# EAGLE design pitching_v1 (EAGLE 9.5.1)
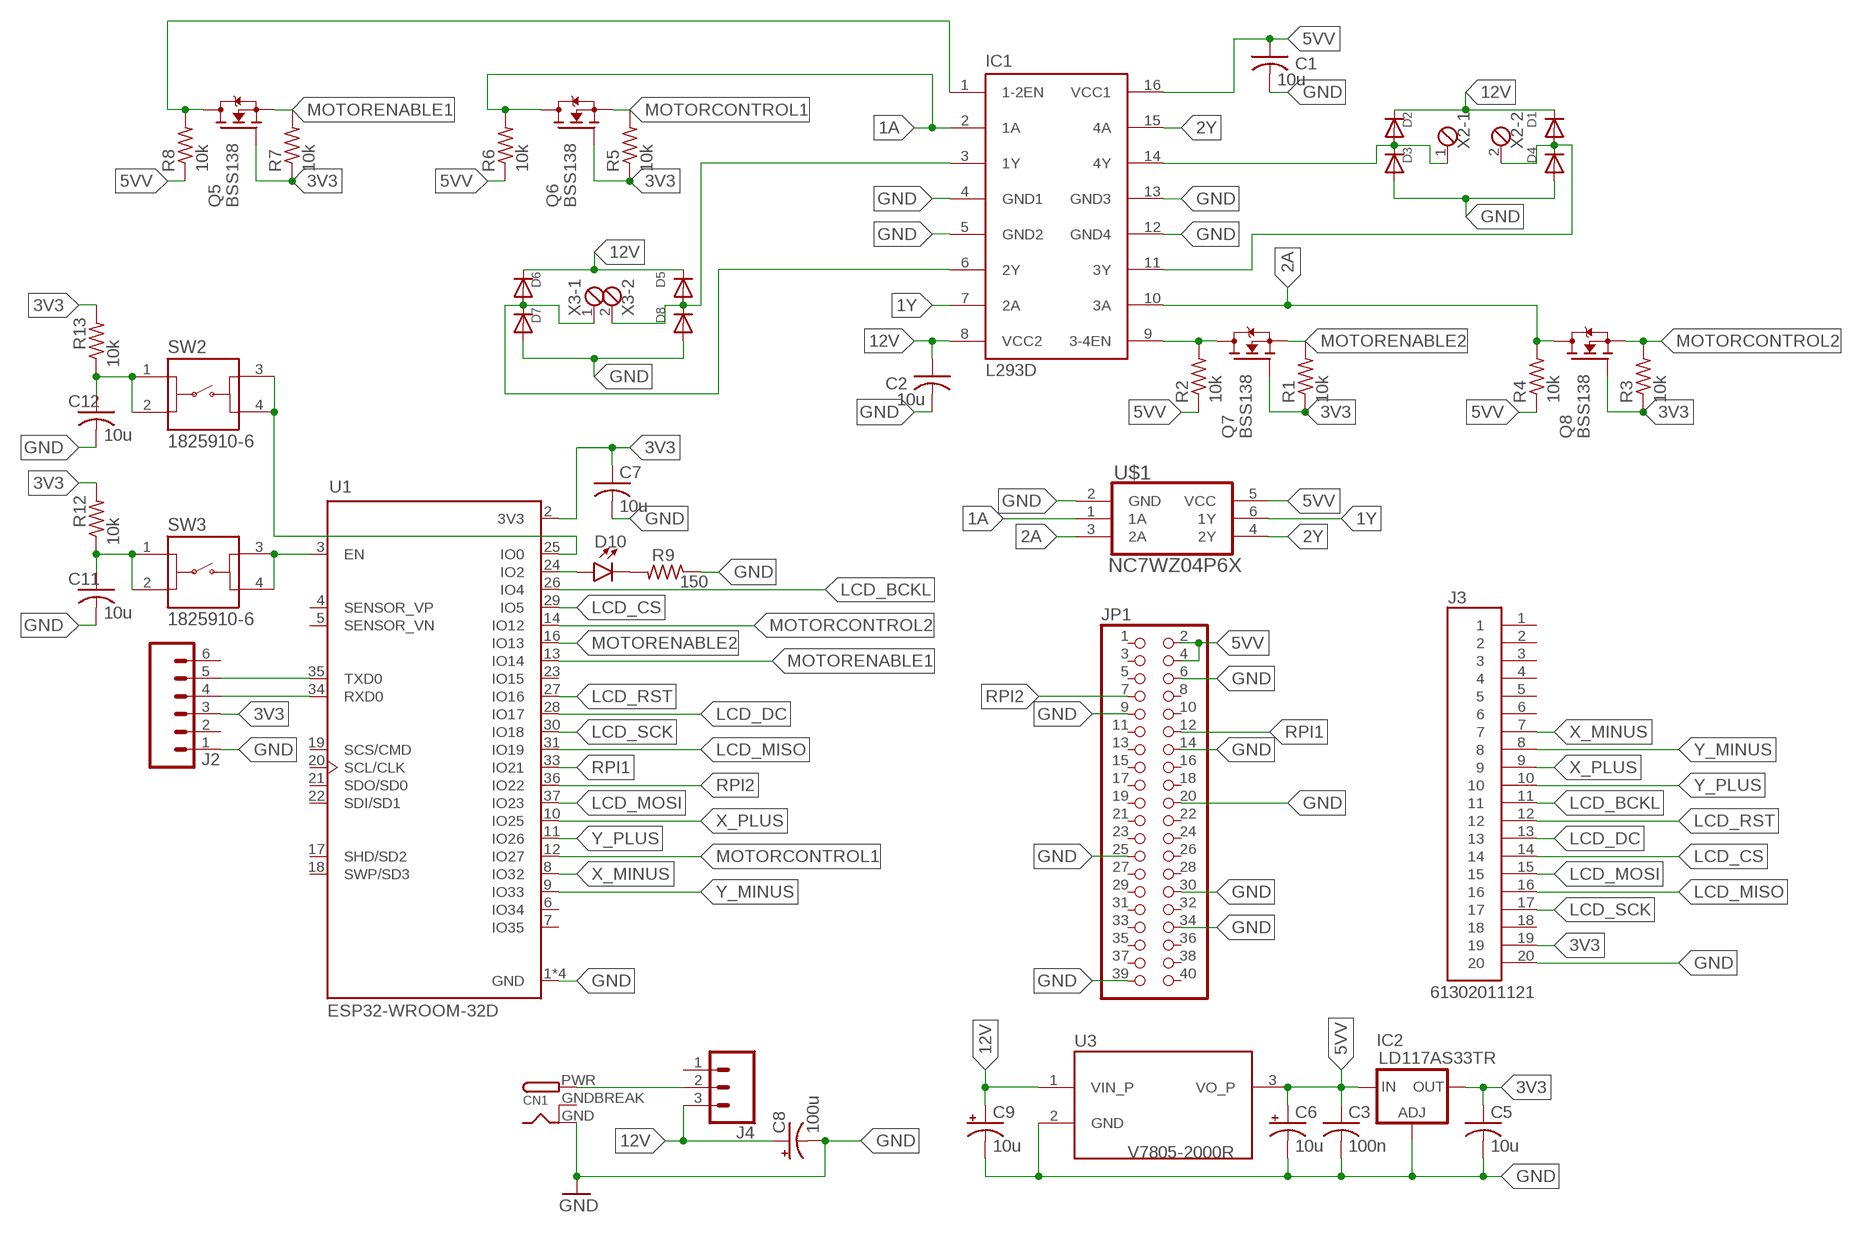
[diagram p0: schematic, sheet 1]

## Parts
C1  10u  C-USC0805  [C0805]
C2  10u  C-USC0805  [C0805]
C3  100n  C-USC0805  [C0805]
C5  10u  C-USC0805  [C0805]
C6  10u  CPOL-US153CLV-0405  [153CLV-0405]
C7  10u  C-USC0805  [C0805]
C8  100u  CPOL-US153CLV-0810  [153CLV-0810]
C9  10u  CPOL-US153CLV-0405  [153CLV-0405]
C11  10u  C-USC0805  [C0805]
C12  10u  C-USC0805  [C0805]
CN1  DCBARRELPTH  [DCJACK_2MM_PTH]
D1  DIODESMA  [SMADIODE]
D2  DIODESMA  [SMADIODE]
D3  DIODESMA  [SMADIODE]
D4  DIODESMA  [SMADIODE]
D5  DIODESMA  [SMADIODE]
D6  DIODESMA  [SMADIODE]
D7  DIODESMA  [SMADIODE]
D8  DIODESMA  [SMADIODE]
D10  LED3MM  [LED_3MM]
IC1  L293D  [DIL16]
IC2  LD117AS33TR  [SOT223]
J2  CONN_06NO_SILK_FEMALE_PTH  [1X06_NO_SILK]
J3  61302011121  [61302011121]
J4  CONN_03  [1X03]
JP1  PINHD-2X20  [2X20]
Q5  BSS138  [SOT23]
Q6  BSS138  [SOT23]
Q7  BSS138  [SOT23]
Q8  BSS138  [SOT23]
R1  10k  R-US_R0805  [R0805]
R2  10k  R-US_R0805  [R0805]
R3  10k  R-US_R0805  [R0805]
R4  10k  R-US_R0805  [R0805]
R5  10k  R-US_R0805  [R0805]
R6  10k  R-US_R0805  [R0805]
R7  10k  R-US_R0805  [R0805]
R8  10k  R-US_R0805  [R0805]
R9  150  R-US_R0805  [R0805]
R12  10k  R-US_R0805  [R0805]
R13  10k  R-US_R0805  [R0805]
SW2  1825910-6  [1825910-6]
SW3  1825910-6  [1825910-6]
U1  ESP32-WROOM-32D  [MODULE_ESP32-WROOM-32D]
U3  V7805-2000R  [CONV_V7805-2000R]
U$1  NC7WZ04P6X  [SOT65P210X110-6N]
X2  MPT2  [2POL254]
X3  MPT2  [2POL254]

## Nets
1A: IC1.2(1A) Q6.3(D) R6.2 U$1.1(1A)
1Y: IC1.7(2A) U$1.6(1Y)
2A: IC1.10(3A) Q8.3(D) R4.2 U$1.3(2A)
2Y: IC1.15(4A) U$1.4(2Y)
3V3: C5.1 C7.1 IC2.4(OUT) J2.3 J3.19 Q5.1(G) Q6.1(G) Q7.1(G) Q8.1(G) R1.1 R3.1 R5.1 R7.1 R12.2 R13.2 U1.2(3V3)
5VV: C1.1 C3.1 C6.+ IC1.16(VCC1) IC2.3(IN) JP1.2 JP1.4 R2.1 R4.1 R6.1 R8.1 U3.3(VO_P) U$1.5(VCC)
12V: C2.1 C8.+ C9.+ D1.C D2.C D5.C D6.C IC1.8(VCC2) J4.3 U3.1(VIN_P)
GND: C1.2 C2.2 C3.2 C5.2 C6.- C7.2 C8.- C9.- C11.2 C12.2 CN1.GND D3.A D4.A D7.A D8.A IC1.4(GND1) IC1.5(GND2) IC1.12(GND4) IC1.13(GND3) IC2.1(ADJ) J2.1 J3.20 JP1.6 JP1.9 JP1.14 JP1.20 JP1.25 JP1.30 JP1.34 JP1.39 R9.1 U1.1(GND) U1.15(GND) U1.38(GND) U1.39(GND) U3.2(GND) U$1.2(GND)
LCD_BCKL: J3.11 U1.26(IO4)
LCD_CS: J3.14 U1.29(IO5)
LCD_DC: J3.13 U1.28(IO17)
LCD_MISO: J3.16 U1.31(IO19)
LCD_MOSI: J3.15 U1.37(IO23)
LCD_RST: J3.12 U1.27(IO16)
LCD_SCK: J3.17 U1.30(IO18)
MOTORCONTROL1: Q6.2(S) R5.2 U1.12(IO27)
MOTORCONTROL2: Q8.2(S) R3.2 U1.14(IO12)
MOTORENABLE1: Q5.2(S) R7.2 U1.13(IO14)
MOTORENABLE2: Q7.2(S) R1.2 U1.16(IO13)
N$1: CN1.PWR J4.2
N$4: D6.A D7.C IC1.6(2Y) X3.1
N$5: D5.A D8.C IC1.3(1Y) X3.2
N$6: D2.A D3.C IC1.14(4Y) X2.1
N$8: D1.A D4.C IC1.11(3Y) X2.2
N$10: IC1.1(1-2EN) Q5.3(D) R8.2
N$11: IC1.9(3-4EN) Q7.3(D) R2.2
N$12: SW2.3 SW2.4 U1.25(IO0)
N$13: D10.K(C) R9.2
N$16: J2.5 U1.35(TXD0)
N$21: J2.4 U1.34(RXD0)
N$24: C11.1 R12.1 SW3.1 SW3.2
N$25: C12.1 R13.1 SW2.1 SW2.2
N$26: D10.A U1.24(IO2)
N$27: SW3.3 SW3.4 U1.3(EN)
RPI1: JP1.12 U1.33(IO21)
RPI2: JP1.7 U1.36(IO22)
X_MINUS: J3.7 U1.8(IO32)
X_PLUS: J3.9 U1.10(IO25)
Y_MINUS: J3.8 U1.9(IO33)
Y_PLUS: J3.10 U1.11(IO26)
Unconnected: J2.2 J2.6 J3.1 J3.2 J3.3 J3.4 J3.5 J3.6 J3.18 J4.1 JP1.1 JP1.3 JP1.5 JP1.8 JP1.10 JP1.11 JP1.13 JP1.15 JP1.16 JP1.17 JP1.18 JP1.19 JP1.21 JP1.22 JP1.23 JP1.24 JP1.26 JP1.27 JP1.28 JP1.29 JP1.31 JP1.32 JP1.33 JP1.35 JP1.36 JP1.37 JP1.38 JP1.40 U1.4(SENSOR_VP) U1.5(SENSOR_VN) U1.6(IO34) U1.7(IO35) U1.17(SHD/SD2) U1.18(SWP/SD3) U1.19(SCS/CMD) U1.20(SCL/CLK) U1.21(SDO/SD0) U1.22(SDI/SD1) U1.23(IO15)

## Power pins joined to a net without a drawn wire
GNDBREAK: CN1.GNDBREAK

## Library data of the parts
C1-C3 C5 C7 C11 C12 = resistor:C-US: CAPACITOR, American symbol
C6 C8 C9 = rcl:CPOL-US: POLARIZED CAPACITOR, American symbol; SPICEPREFIX: C
CN1 = adafruit:DCBARREL: 2.0mm DC Barrel Jack DCJACK_2MM_PTH - Through Hole Jack (4UConnector: 05537)
D1-D8 = adafruit:DIODE: Diode SMADIODE - SMA Surface Mount Package 20V 1A Schottky Diode Digikey: 641-1014-6-ND DO-1N4148 - Through Hole Small Current Diode SOD-123 20V 1 A (.5mV Vf) Schottky Diode - Digikey: MBRX120TPMSCT-ND SOD-323 10V 570mA (.38mV Vf, 3ns) Schottky Diode - Digikey: ZLLS410CT-ND SOD-523 30V 30mA Schottky Diode (RB751S-40TE61) - Digikey: RB751S-40TE61CT-ND SOT23-R/W - SOT23 Package (R = Solder Paste/Reflow Ovens, W = Hand-Soldering) BAT54Film 40V 300mA - Digikey: 497-7162-1-ND
D10 = SparkFun-LED:LED: LED (Generic) Standard schematic elements and footprints for 5mm, 3mm, 1206, and 0603 sized LEDs. Generic LEDs with no color specified.; PROD_ID: DIO-08794
IC1 = st-microelectronics:L293D: PUSH-PULL 4 CHANNEL DRIVER; MPN: L293D; OC_FARNELL: 9589619; OC_NEWARK: 56P8249
IC2 = v-reg:LD117A?*: Low drop fixed and adjustable positive voltage regulators 1 A Source: http://www.st.com/stonline/products/literature/ds/7194/ld1117axx.pdf
J2 = SparkFun-Connectors:CONN_06: Multi connection point. Often used as Generic Header-pin footprint for 0.1 inch spaced/style header connections On any of the 0.1 inch spaced packages, you can populate with these: Break Away Headers - Straight <https://www.sparkfun.com/products/116> (PRT-00116) Break Away Male Headers - Right Angle <https://www.sparkfun.com/products/553> (PRT-00553) Female Headers <https://www.sparkfun.com/products/115> (PRT-00115) Break Away Headers - Machine Pin <https://www.sparkfun.com/products/117> (PRT-00117) Break Away Female Headers - Swiss Machine Pin <https://www.sparkfun.com/products/743> (PRT-00743) Arduino Stackable Header - 6 Pin <https://www.sparkfun.com/products/9280> (PRT-09280) For SCREWTERMINALS and SPRING TERMINALS visit here: Screw Terimnals on SparkFun.com <https://www.sparkfun.com/search/results?term=Screw+Terminals> (5mm/3.5mm/2.54mm spacing) This device is also useful as a general connection point to wire up your design to another part of your project. Our various solder wires solder well into these plated through hole pads. Hook-Up Wire - Assortment (Stranded, 22 AWG) <https://www.sparkfun.com/products/11375> (PRT-11375) Hook-Up Wire - Assortment (Solid Core, 22 AWG) <https://www.sparkfun.com/products/11367> (PRT-11367) View the entire wire category on our website here <https://www.sparkfun.com/categories/141>; PROD_ID: CONN-08437
J3 = Headers:61302011121: CONN HEADER VERT 20POS 2.54MM Manufacturer's datasheet <https://katalog.we-online.de/em/datasheet/6130xx11121.pdf>; CREATED_BY: PCBLayout.com; DIGIKEY_PART_NUMBER: 732-5329-ND; MANUFACTURER: Wurth Electronics Inc.; MPN: 61302011121
J4 = SparkFun-Connectors:CONN_03: Multi connection point. Often used as Generic Header-pin footprint for 0.1 inch spaced/style header connections On any of the 0.1 inch spaced packages, you can populate with these: Break Away Headers - Straight <https://www.sparkfun.com/products/116> (PRT-00116) Break Away Male Headers - Right Angle <https://www.sparkfun.com/products/553> (PRT-00553) Female Headers <https://www.sparkfun.com/products/115> (PRT-00115) Break Away Headers - Machine Pin <https://www.sparkfun.com/products/117> (PRT-00117) Break Away Female Headers - Swiss Machine Pin <https://www.sparkfun.com/products/743> (PRT-00743) Stackable Header - 3 Pin (Female, 0.1") <https://www.sparkfun.com/products/13875> (PRT-13875) For SCREWTERMINALS and SPRING TERMINALS visit here: Screw Terimnals on SparkFun.com <https://www.sparkfun.com/search/results?term=Screw+Terminals> (5mm/3.5mm/2.54mm spacing) This device is also useful as a general connection point to wire up your design to another part of your project. Our various solder wires solder well into these plated through hole pads. Hook-Up Wire - Assortment (Stranded, 22 AWG) <https://www.sparkfun.com/products/11375> (PRT-11375) Hook-Up Wire - Assortment (Solid Core, 22 AWG) <https://www.sparkfun.com/products/11367> (PRT-11367) View the entire wire category on our website here <https://www.sparkfun.com/categories/141> Special notes: Molex polarized connector foot print use with SKU : PRT-08232 with associated crimp pins and housings.
JP1 = adafruit:PINHD-2X20: PIN HEADER
Q5-Q8 = bss138_10:BSS138: BSS138 N-Channel Logic Level Enhancement Mode Field Effect Transistor Source: http://www.fairchildsemi.com/datasheets/BS/BSS138.pdf; MF: Fairchild; MPN: BSS138; OC_FARNELL: 9845330; OC_NEWARK: 67R2009
R1-R9 R12 R13 = rcl:R-US_: RESISTOR, American symbol; SPICEPREFIX: R
SW2 SW3 = Switch:1825910-6: SWITCH TACTILE SPST-NO 0.05A 24V Manufacturer's datasheet <https://www.te.com/commerce/DocumentDelivery/DDEController?Action=srchrtrv&DocNm=1825910&DocType=Customer+Drawing&DocLang=English>; CREATED_BY: PCBLayout.com; DIGIKEY_PART_NUMBER: 450-1650-ND; MANUFACTURER: TE Connectivity ALCOSWITCH Switches; MPN: 1825910-6
U1 = ESP32-WROOM-32D:ESP32-WROOM-32D: IC: SoC; GPIO, I2C, I2S, IR, SD, SDIO, SPI, UART; 2.7÷3.6VDC; 20dBm; AVAILABILITY: Unavailable; DESCRIPTION: IC: SoC; GPIO, I2C, I2S, IR, SD, SDIO, SPI, UART; 2.7÷3.6VDC; 20dBm; MF: Espressif Systems; MP: ESP32-WROOM-32D; PACKAGE: Module Espressif Systems; PRICE: None
U3 = V7805-2000R:V7805-2000R; MANUFACTURER: CUI INC; PARTREV: 1.03; STANDARD: MANUFACTURER RECOMMENDATIONS
U$1 = NC7WZ04P6X:NC7WZ04P6X
X2 X3 = con-phoenix-254:MPT2: PHOENIX CONNECTOR; OC_FARNELL: unknown; OC_NEWARK: unknown

## Board
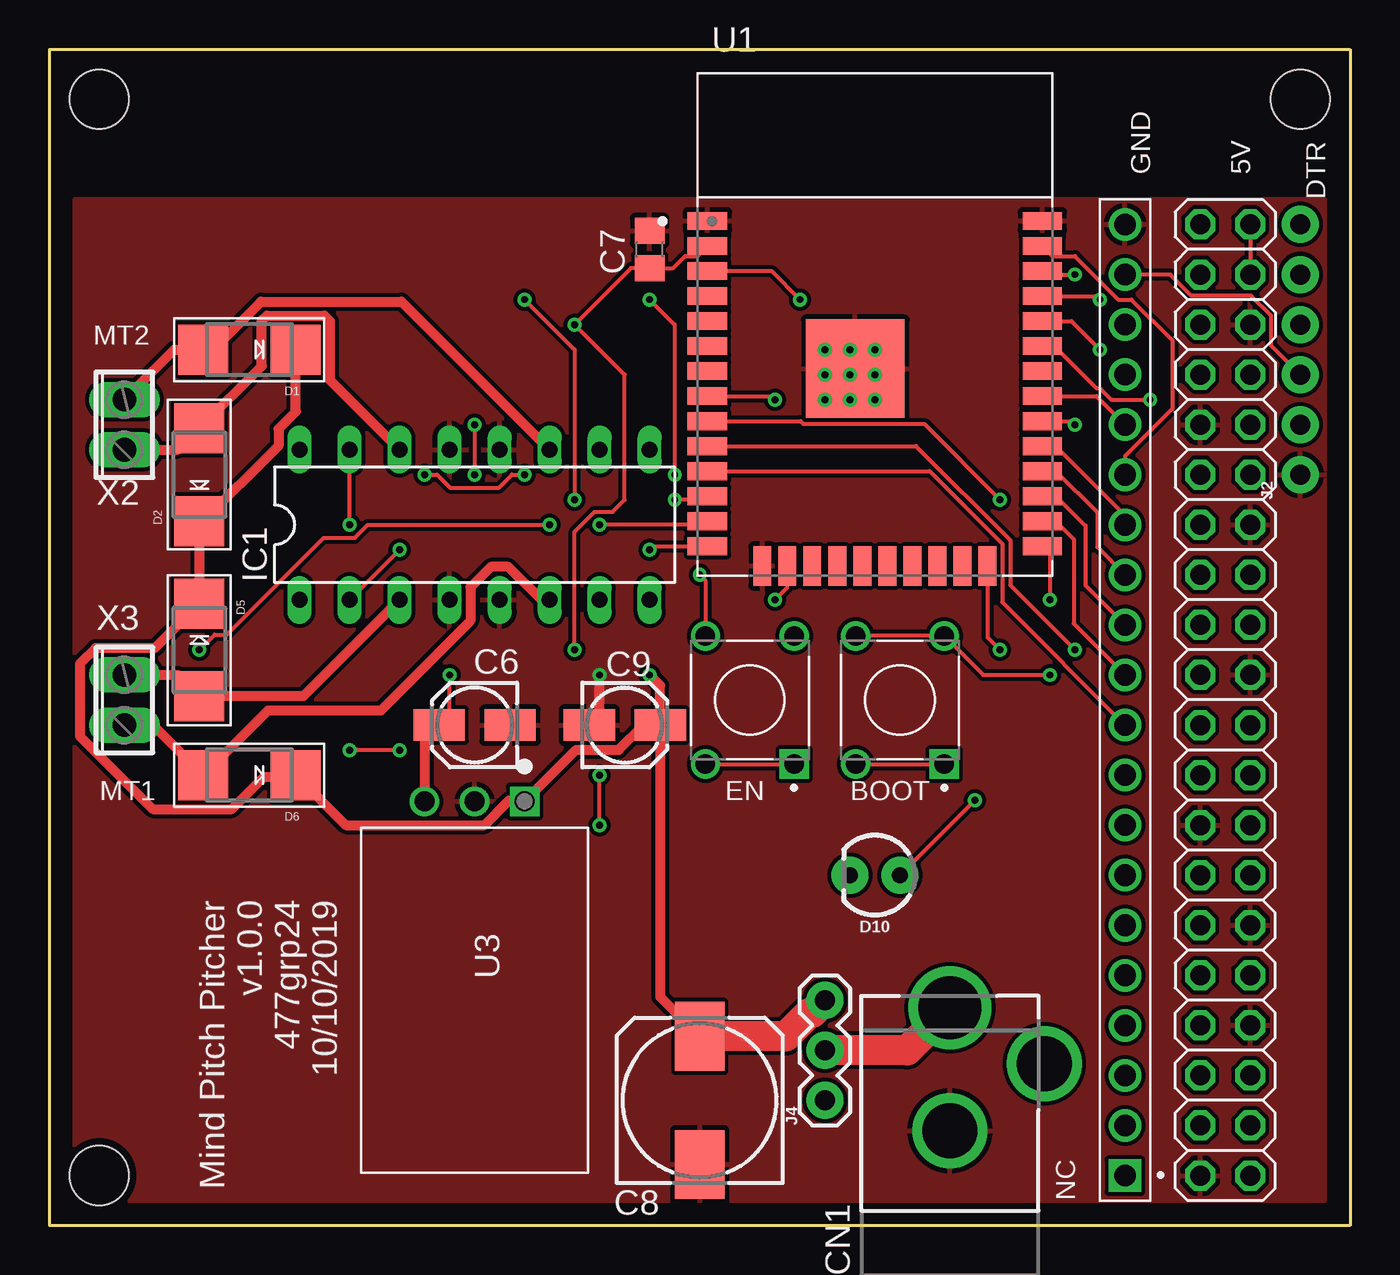
[diagram p1: board, top side]
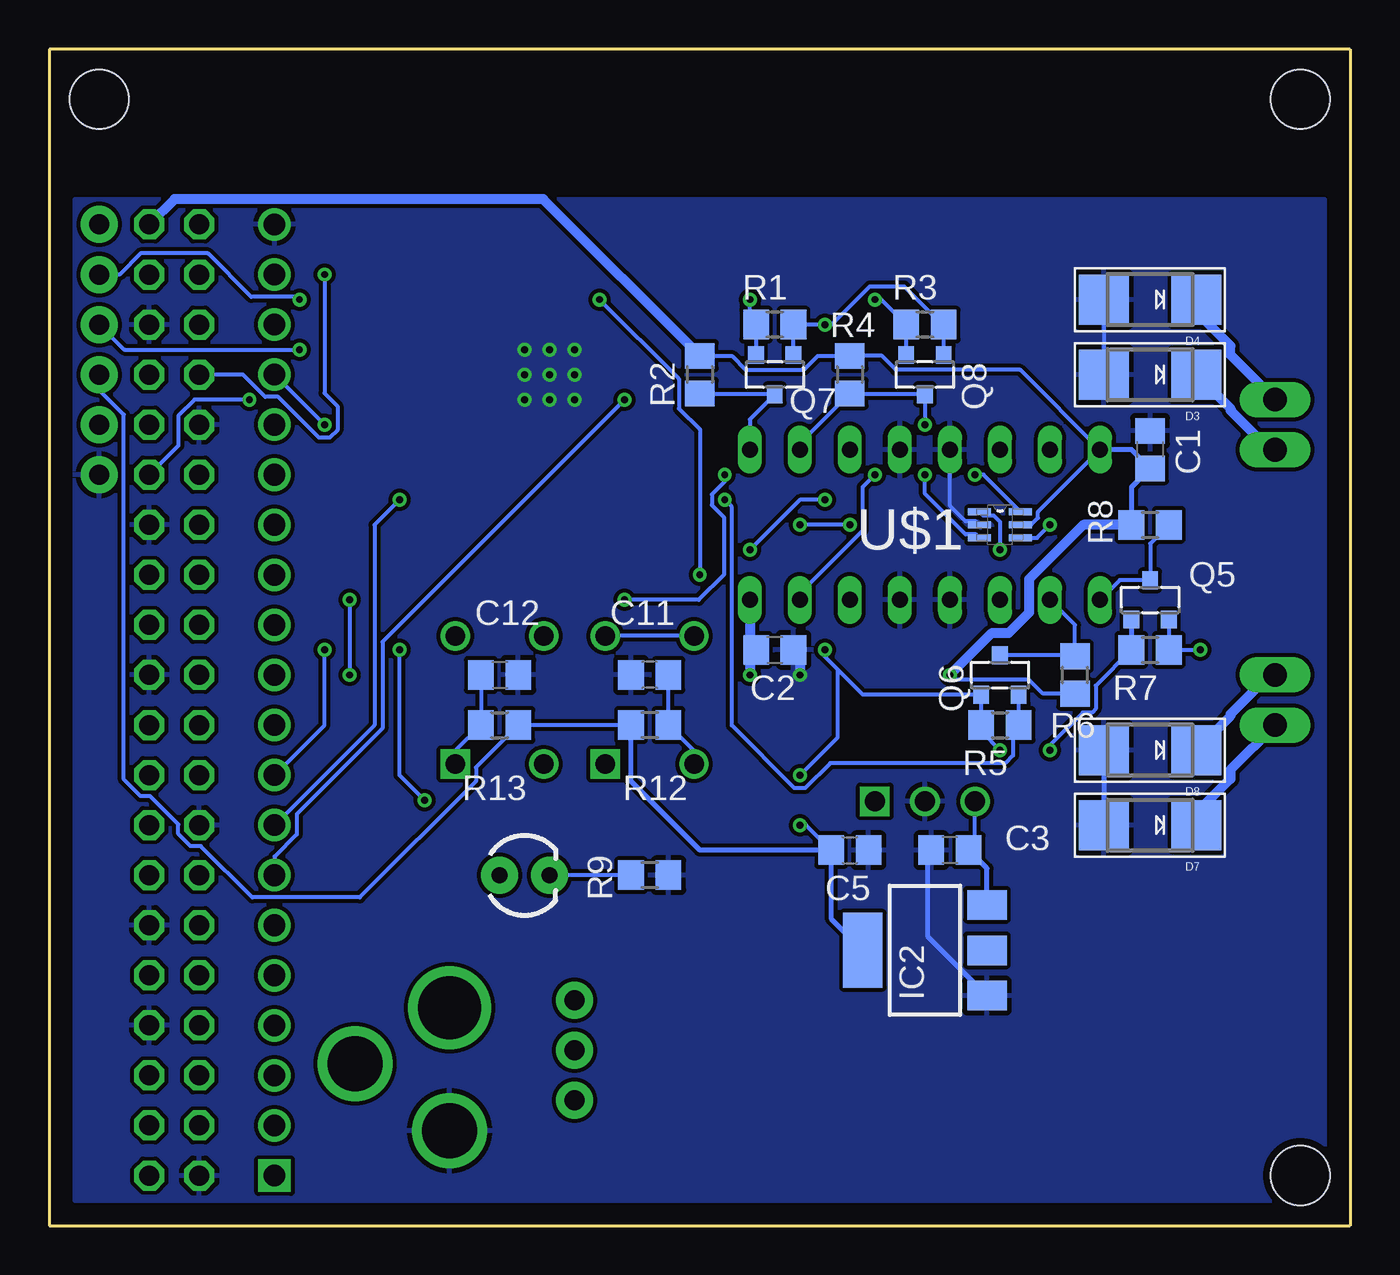
[diagram p2: board, bottom side, seen from below]

Size 66.04 x 59.69 mm. Coordinates in mm from the lower left corner, seen from the top.
Outline: 0,59.69 66.04,59.69 66.04,0 0,0 0,59.69
Copper layers (1*16): Top 0.0356mm / dielectric 1.5011mm / Bottom 0.0356mm
Design rules "ECE_Senior_Design": minimum track width 8mil, minimum drill 13mil, track to track 8mil, track to pad 8mil, pad to pad 6mil, via to via 8mil, smd to smd 6mil, copper to edge 15mil, drill to drill 8mil, minimum pad ring 7mil, minimum via ring 7mil, stop-mask expansion 3mil, vias tented up to drill 0mil, thermal gap 10mil
Holes 3 mm at 2.54,57.15 63.5,57.15 2.54,2.54

### Footprints (pad centres in the part's own frame; a part is rotated, then mirrored left to right if it is on the bottom)
C0805 = smd 1.3 x 1.5: 1 -0.95,0; 2 0.95,0
153CLV-0405 = smd 2.6 x 1.6: + 1.8,0; - -1.8,0
153CLV-0810 = smd 3.5 x 2.5: + 3.25,0; - -3.25,0
DCJACK_2MM_PTH = drill 2.8: GND 0,7.35; GNDBREAK 4.8,10.75 | drill 3.2: PWR 0,13.6
SMADIODE = smd 2.54 x 2.54: A 2.349,0; C -2.349,0
LED_3MM = drill 0.813 pad 1.88: A -1.27,0; K 1.27,0
DIL16 = drill 0.813 long: 1 -8.89,-3.81; 2 -6.35,-3.81; 3 -3.81,-3.81; 4 -1.27,-3.81; 5 1.27,-3.81; 6 3.81,-3.81; 7 6.35,-3.81; 8 8.89,-3.81; 9 8.89,3.81; 10 6.35,3.81; 11 3.81,3.81; 12 1.27,3.81; 13 -1.27,3.81; 14 -3.81,3.81; 15 -6.35,3.81; 16 -8.89,3.81
SOT223 = smd 1.5 x 2: 1 -2.3,-3.15; 2 0,-3.15; 3 2.3,-3.15 | smd 3.8 x 2: 4 0,3.15
1X06_NO_SILK = drill 1.016 pad 1.88: 1 0,0; 2 2.54,0; 3 5.08,0; 4 7.62,0; 5 10.16,0; 6 12.7,0
61302011121 = drill 1.1 square: 1 -24.13,0 | drill 1.1: 2 -21.59,0; 3 -19.05,0; 4 -16.51,0; 5 -13.97,0; 6 -11.43,0; 7 -8.89,0; 8 -6.35,0; 9 -3.81,0; 10 -1.27,0; 11 1.27,0; 12 3.81,0; 13 6.35,0; 14 8.89,0; 15 11.43,0; 16 13.97,0; 17 16.51,0; 18 19.05,0; 19 21.59,0; 20 24.13,0
1X03 = drill 1.016 pad 1.88: 1 0,0; 2 2.54,0; 3 5.08,0
2X20 = drill 1.016 octagon: 1 -24.13,-1.27; 2 -24.13,1.27; 3 -21.59,-1.27; 4 -21.59,1.27; 5 -19.05,-1.27; 6 -19.05,1.27; 7 -16.51,-1.27; 8 -16.51,1.27; 9 -13.97,-1.27; 10 -13.97,1.27; 11 -11.43,-1.27; 12 -11.43,1.27; 13 -8.89,-1.27; 14 -8.89,1.27; 15 -6.35,-1.27; 16 -6.35,1.27; 17 -3.81,-1.27; 18 -3.81,1.27; 19 -1.27,-1.27; 20 -1.27,1.27; 21 1.27,-1.27; 22 1.27,1.27; 23 3.81,-1.27; 24 3.81,1.27; 25 6.35,-1.27; 26 6.35,1.27; 27 8.89,-1.27; 28 8.89,1.27; 29 11.43,-1.27; 30 11.43,1.27; 31 13.97,-1.27; 32 13.97,1.27; 33 16.51,-1.27; 34 16.51,1.27; 35 19.05,-1.27; 36 19.05,1.27; 37 21.59,-1.27; 38 21.59,1.27; 39 24.13,-1.27; 40 24.13,1.27
SOT23 = smd 0.8 x 0.9: 1 -0.95,-1; 2 0.95,-1; 3 0,1
R0805 = smd 1.3 x 1.5: 1 -0.95,0; 2 0.95,0
1825910-6 = drill 0.99 square: 1 3.25,2.25 | drill 0.99: 2 3.25,-2.25; 3 -3.25,2.25; 4 -3.25,-2.25
MODULE_ESP32-WROOM-32D = smd 2 x 0.9: 1 -8.5,5.26; 2 -8.5,3.99; 3 -8.5,2.72; 4 -8.5,1.45; 5 -8.5,0.18; 6 -8.5,-1.09; 7 -8.5,-2.36; 8 -8.5,-3.63; 9 -8.5,-4.9; 10 -8.5,-6.17; 11 -8.5,-7.44; 12 -8.5,-8.71; 13 -8.5,-9.98; 14 -8.5,-11.25; 25 8.5,-11.25; 26 8.5,-9.98; 27 8.5,-8.71; 28 8.5,-7.44; 29 8.5,-6.17; 30 8.5,-4.9; 31 8.5,-3.63; 32 8.5,-2.36; 33 8.5,-1.09; 34 8.5,0.18; 35 8.5,1.45; 36 8.5,2.72; 37 8.5,3.99; 38 8.5,5.26 | smd 0.9 x 2: 15 -5.715,-12.25; 16 -4.445,-12.25; 17 -3.175,-12.25; 18 -1.905,-12.25; 19 -0.635,-12.25; 20 0.635,-12.25; 21 1.905,-12.25; 22 3.175,-12.25; 23 4.445,-12.25; 24 5.715,-12.25 | smd 5 x 5: 39 -1,-2.24
CONV_V7805-2000R = drill 1 square: 1 -10.1,2.54 | drill 1: 2 -10.1,0; 3 -10.1,-2.54
SOT65P210X110-6N = smd 1.168 x 0.356: 1 -1.041,0.66; 2 -1.041,0; 3 -1.041,-0.66; 4 1.041,-0.66; 5 1.041,0; 6 1.041,0.66
2POL254 = drill 1.2 long: 1 -1.27,0; 2 1.27,0

### Placement (x,y rotation side)
C1  10.16,39.37 90 bottom
C2  29.21,29.21 0 bottom
C3  20.32,19.05 180 bottom
C5  25.4,19.05 0 bottom
C6  21.59,25.4 180 top
C7  30.48,49.53 90 top
C8  33.02,6.35 90 top
C9  29.21,25.4 0 top
C11  35.56,27.94 180 bottom
C12  43.18,27.94 0 bottom
CN1  45.72,-2.54 0 top
D1  10.16,44.45 180 top
D2  7.62,38.1 90 top
D3  10.16,43.18 180 bottom
D4  10.16,46.99 180 bottom
D5  7.62,29.21 270 top
D6  10.16,22.86 180 top
D7  10.16,20.32 180 bottom
D8  10.16,24.13 180 bottom
D10  41.91,17.78 180 top
IC1  21.59,35.56 0 top
IC2  21.59,13.97 90 bottom
J2  63.5,38.1 90 top
J3  54.61,26.67 90 top
J4  39.37,6.35 90 top
JP1  59.69,26.67 270 top
Q5  10.16,31.75 0 bottom
Q6  17.78,27.94 0 bottom
Q7  29.21,43.18 180 bottom
Q8  21.59,43.18 180 bottom
R1  29.21,45.72 180 bottom
R2  33.02,43.18 270 bottom
R3  21.59,45.72 180 bottom
R4  25.4,43.18 270 bottom
R5  17.78,25.4 0 bottom
R6  13.97,27.94 90 bottom
R7  10.16,29.21 0 bottom
R8  10.16,35.56 0 bottom
R9  35.56,17.78 180 bottom
R12  35.56,25.4 180 bottom
R13  43.18,25.4 0 bottom
SW2  43.18,26.67 270 top
SW3  35.56,26.67 270 top
U1  41.91,45.72 0 top
U3  21.59,11.43 270 top
U$1  17.78,35.56 0 bottom
X2  3.81,40.64 90 top
X3  3.81,26.67 90 top

### Tracks (layer width: path | path; a pad name or v marks a point on that pad's centre or on a via)
1A  (via drill 0.35 pad 0.55)
  Top 0.203: IC1.2 v17.78,34.29
  Bottom 0.203: IC1.2 13.97,30.48 R6.2 14.02,28.94 Q6.3 | U$1.1 18.64,36.04 18.11,36.04 17.78,35.71 v17.78,34.29
1Y  (via drill 0.35 pad 0.55)
  Top 0.203: v19.05,38.1 19.69,38.1 20.34,37.44 22.84,37.44 23.49,38.1 v24.13,38.1
  Bottom 0.203: U$1.6 18.62,38.1 v19.05,38.1 | IC1.7 27.94,32.09 24.74,35.29 24.74,37.49 v24.13,38.1
2A  (via drill 0.35 pad 0.55)
  Top 0.203: v21.59,40.64 v21.59,38.1
  Bottom 0.203: IC1.10 27.94,39.69 R4.2 25.35,42.18 Q8.3 v21.59,40.64 | U$1.3 19,35.08 19.53,35.08 21.59,37.14 v21.59,38.1
2Y  (via drill 0.35 pad 0.55)
  Top 0.203: v15.24,35.56 IC1.15
  Bottom 0.203: U$1.4 15.9,34.9 v15.24,35.56
3V3  (via drill 0.35 pad 0.55)
  Top 0.203: U1.2 32.9,49.2 32.28,49.2 31.67,48.58 C7.1 29.53,48.58 v26.67,45.72 29.21,43.18 29.21,36.83 28.6,36.22 27.67,36.22 26.67,35.22 v26.67,29.21 | J2.3 62.03,44.65 62.03,46.16 60.99,47.19 57.98,47.19 56.91,48.26 J3.19 | v27.94,20.32 v27.94,22.86 | v17.78,24.13 v15.24,24.13
  Bottom 0.203: Q8.1 R3.1 20.71,45.72 22.64,47.65 24.4,47.65 26.33,45.72 v26.67,45.72 R1.1 Q7.1 | R7.1 12.91,27.41 12.91,26.21 13.09,26.04 13.57,26.04 15.24,24.37 v15.24,24.13 | C5.1 27.62,20.32 v27.94,20.32 | v26.67,29.21 26.67,28.87 26.01,28.21 | 26.01,28.21 26.01,24.79 v27.94,22.86 | R12.2 R13.2 44.38,23.25 44.38,22.55 50.28,16.65 55.74,16.65 58.34,19.25 58.86,19.25 59.49,19.88 59.49,20.36 60.92,21.79 61.4,21.79 62.26,22.65 62.26,41.16 63.5,42.4 J2.3 | 26.01,28.21 24.74,26.94 Q6.1 R5.1 18.73,25.08 v17.78,24.13
  Bottom 0.254: IC2.4 26.35,15.58 C5.1 33.02,19.05 36.51,22.54 R12.2 | Q5.1 R7.1
5VV  (via drill 0.35 pad 0.55)
  Top 0.203: JP1.2 JP1.4 | C6.+ 20.32,25.93 v20.32,27.94
  Top 0.508: C6.+ 19.05,24.66 U3.3
  Bottom 0.203: R2.1 31.39,44.13 30.69,43.42 27.73,43.42 27.03,44.13 R4.1 23.77,44.13 23.07,43.42 16.75,43.42 IC1.16 15.85,36.22 15.85,35.92 16.21,35.56 U$1.5 | C3.1 19.05,19.37 U3.3 | R6.1 15.6,26.99 16.3,27.7 20.07,27.7 v20.32,27.94
  Bottom 0.254: IC2.3 18.44,18.12 C3.1 | R8.1 11.11,37.47 C1.1 11.11,39.37 IC1.16
  Bottom 0.508: v20.32,27.94 18.19,30.07 17.34,30.07 16.31,31.11 16.31,32.8 13.55,35.56 R8.1 | R2.1 40.97,52.08 59.68,52.08 JP1.2
12V  (via drill 0.35)
  Top 0.508: C9.+ 31.01,27.41 v30.48,27.94 | D2.C 7.62,35.56 | 7.62,35.56 D5.C 5.36,29.3 2.35,29.3 1.55,28.5 1.55,24.84 5.26,21.13 9.27,21.13 10.9,22.77 12.61,22.77 | U3.1 24.16,21.56 | 24.16,21.56 26.74,24.14 28.9,24.14 30.16,25.4 C9.+ | C9.+ 31.01,11.61 C8.+ | 24.16,21.56 23.33,21.56 22.09,20.32 15.05,20.32 12.61,22.77 | D6.C 12.61,22.77 | 7.62,35.56 11.63,39.57 11.63,40.42 12.51,41.3 D1.C
  Top 1.524: J4.3 38.73,10.79 38.58,10.79 37.39,9.6 C8.+
  Bottom 0.508: IC1.8 30.48,29.53 C2.1 30.48,28.89 v30.48,27.94
GND  (via drill 0.35 pad 0.55)
  Top 0.508: C9.- 27.94,25.93 v27.94,27.94
  Bottom 0.203: D4.A D3.A | U$1.2 19,35.74 19.53,35.74 20.32,36.53 IC1.13
  Bottom 0.254: C3.2 21.43,19.21 21.43,14.66 IC2.1 | D8.A D7.A
  Bottom 0.508: C2.2 27.94,28.89 v27.94,27.94
  other vias: 39.37,44.45 40.64,44.45 41.91,44.45 41.91,43.18 41.91,41.91 40.64,41.91 40.64,43.18 39.37,43.18 39.37,41.91
  pour Top: 1.27,1.27 64.77,1.27 64.77,52.07 1.27,52.07
  pour Bottom: 1.27,52.07 64.77,52.07 64.77,1.27 1.27,1.27
LCD_BCKL
  Top 0.203: J3.11 52,30.55 52,34.84 51.1,35.74 U1.26
LCD_CS
  Top 0.203: J3.14 54.61,36.04 51.1,39.55 U1.29
LCD_DC
  Top 0.203: J3.13 53.19,34.44 53.19,36.19 51.1,38.28 U1.28
LCD_MISO
  Top 0.203: U1.31 53.16,42.09 J3.16
LCD_MOSI
  Top 0.203: U1.37 50.92,49.2 52.06,49.2 54.27,46.99 54.94,46.99 57.01,44.92 57.01,41.44 54.61,39.04 J3.15
LCD_RST
  Top 0.203: J3.12 52.6,32.49 52.6,35.52 51.1,37.01 U1.27
LCD_SCK  (via drill 0.35 pad 0.55)
  Top 0.203: U1.30 51.89,40.82 v52.07,40.64
  Bottom 0.203: v52.07,40.64 J3.17
MOTORCONTROL1  (via drill 0.35 pad 0.55)
  Top 0.203: U1.12 33.23,36.83 v31.75,36.83
  Bottom 0.203: Q6.2 R5.2 17.12,25.11 17.12,23.86 17.51,23.47 26.4,23.47 27.67,22.2 28.21,22.2 31.39,25.38 31.39,36.47 v31.75,36.83
MOTORCONTROL2  (via drill 0.35, 0.35 pad 0.55)
  Top 0.203: v24.13,46.99 26.67,44.45 v26.67,36.83 | v30.48,34.29 30.66,34.47 U1.14
  Bottom 0.203: v24.13,46.99 23.81,46.99 R3.2 Q8.2 | v26.67,36.83 27.94,36.83 v30.48,34.29
MOTORENABLE1  (via drill 0.35 pad 0.55)
  Top 0.203: U1.13 33.23,35.56 v27.94,35.56 | v7.62,29.21 8.39,29.98 9.02,29.98 13.93,34.9 15.51,34.9 16.17,35.56 v25.4,35.56
  Bottom 0.203: v7.62,29.21 R7.2 Q5.2 | v25.4,35.56 v27.94,35.56
MOTORENABLE2  (via drill 0.35 pad 0.55)
  Top 0.203: v30.48,46.99 31.75,45.72 v31.75,38.1 | v36.83,31.75 37.47,32.38 U1.16
  Bottom 0.203: v30.48,46.99 30.48,46.04 R1.2 Q7.2 | v31.75,38.1 31.75,37.76 32.41,37.1 32.41,36.56 31.8,35.95 31.8,33.02 33.07,31.75 v36.83,31.75
N$1
  Top 1.524: CN1.PWR 43.55,8.89 J4.2
N$4
  Top 0.508: X3.1 5.27,25.4 D6.A 11.1,26.15 16.84,26.15 21.39,30.7 21.39,32.4 22.42,33.43 23.3,33.43 24.98,31.75 IC1.6
  Bottom 0.508: X3.1 6.08,23.13 6.08,22.67 7.81,20.94 D7.C
N$5
  Top 0.508: X3.2 6.54,27.94 D5.A 12.89,26.86 IC1.3
  Bottom 0.508: D8.C 6.07,25.87 6.07,25.96 4.09,27.94 X3.2
N$6
  Top 0.508: X2.1 6.54,39.37 D2.A 10.78,43.61 10.78,45.91 11.05,46.18 13.97,46.18 14.24,45.91 14.24,42.91 IC1.14
  Bottom 0.508: D3.C 6.07,41.44 6.07,41.35 4.09,39.37 X2.1
N$8
  Top 0.508: X2.2 6.35,44.45 D1.A 8.32,44.45 10.76,46.89 17.88,46.89 IC1.11
  Bottom 0.508: X2.2 6.08,44.18 6.08,44.64 7.81,46.37 D4.C
N$10
  Bottom 0.203: IC1.1 11.7,32.75 Q5.3 10.16,34.61 R8.2
N$11
  Bottom 0.203: R2.2 32.97,42.18 Q7.3 30.48,40.91 IC1.9
N$12  (via drill 0.35 pad 0.55)
  Top 0.203: SW2.4 SW2.3 47.41,27.94 v50.8,27.94 | U1.25 50.8,34.08 v50.8,31.75
  Bottom 0.203: v50.8,31.75 v50.8,27.94
N$13
  Bottom 0.203: R9.2 D10.K
N$16  (via drill 0.35 pad 0.55)
  Top 0.203: U1.35 53.16,47.17 v53.34,46.99
  Bottom 0.203: v53.34,46.99 53.48,47.13 55.78,47.13 57.98,49.33 61.4,49.33 62.47,48.26 J2.5
N$21  (via drill 0.35 pad 0.55)
  Top 0.203: U1.34 51.89,45.9 v53.34,44.45
  Bottom 0.203: J2.4 62.23,44.45 v53.34,44.45
N$24
  Top 0.203: SW3.2 SW3.1
  Bottom 0.203: SW3.2 33.31,24.1 R12.1 C11.1
N$25
  Top 0.203: SW2.2 SW2.1
  Bottom 0.203: C12.1 R13.1 45.43,24.1 SW2.1
N$26  (via drill 0.35 pad 0.55)
  Top 0.203: v46.99,21.59 D10.A | U1.24 47.62,29.84 v48.26,29.21
  Bottom 0.203: v48.26,29.21 48.26,22.86 v46.99,21.59
N$27  (via drill 0.35 pad 0.55)
  Top 0.203: U1.3 36.65,48.44 v38.1,46.99 | v33.02,33.02 33.31,32.73 SW3.4
  Bottom 0.203: SW3.4 SW3.3 | v38.1,46.99 34.08,42.97 34.08,41.45 33.02,40.4 v33.02,33.02
RPI1  (via drill 0.35 pad 0.55)
  Top 0.203: U1.33 51.02,44.63 53.16,42.5 53.33,42.5 53.91,41.91 v55.88,41.91
  Bottom 0.203: JP1.12 59.49,39.57 59.49,41.08 58.66,41.91 v55.88,41.91
RPI2  (via drill 0.35 pad 0.55)
  Top 0.203: U1.36 50.59,48.26 v52.07,48.26
  Bottom 0.203: JP1.7 56.21,43.18 55.08,42.05 54.41,42.05 52.34,39.98 51.8,39.98 51.41,40.37 51.41,41.58 52.07,42.24 v52.07,48.26
X_MINUS  (via drill 0.35 pad 0.55)
  Top 0.203: U1.8 36.65,42.09 v36.83,41.91
  Bottom 0.203: v36.83,41.91 49.12,29.62 49.12,25.23 53.48,20.88 53.48,19.85 54.61,18.72 J3.7
X_PLUS  (via drill 0.35 pad 0.55)
  Top 0.203: v52.07,29.21 48.79,32.49 48.79,34.77 44,39.55 U1.10
  Bottom 0.203: J3.9 52.07,25.4 v52.07,29.21
Y_MINUS  (via drill 0.35 pad 0.55)
  Top 0.203: U1.9 38.14,40.82 38.28,40.67 44.41,40.67 v48.26,36.83
  Bottom 0.203: J3.8 49.53,25.4 49.53,35.56 v48.26,36.83
Y_PLUS
  Top 0.203: J3.10 48.38,31.63 48.38,34.6 44.7,38.28 U1.11

### Text on the board
tNames: GND | 5V | DTR | MT2 | MT1 | EN | BOOT | Mind Pitch Pitcher / v1.0.0 / 477grp24 / 10/10/2019 | NC